# Altium project Ex.PrjPCB
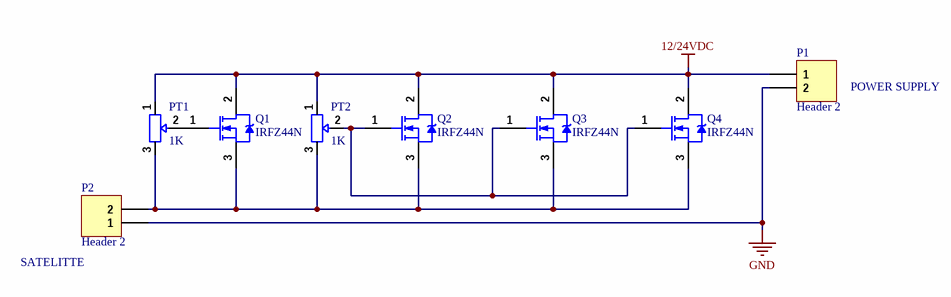
[diagram p0: Charge.SchDoc]
3 sheets, 43 parts. Net scope: global (net labels, ports and power ports of the same name join across sheets).
Sheets:
  Charge.SchDoc
  TEST_BENCH.SchDoc
  TEST_BENCH_2.SchDoc

## Sheet Charge.SchDoc: SCHEMA
size A4; Date: 01/01/2000; Author: Rachid AKKOUCHE; CompanyName: RASoftware; DrawnBy: Rachid AKKOUCHE; Engineer: Rachid AKKOUCHE; Organization: RASoftware; Address1: 52J-03 rue de la crèche; Address3: 77100 MEAUX; Address4: FRANCE; DocumentNumber: 01; Revision: A; SheetNumber: 1; SheetTotal: 1; Dessinepar: Rachid AKKOUCHE; Property: RASoftware; PageSetup: Record=PageOptions|CenterHorizontal=True|CenterVertical=True|PrintScale=0.88|XCorrection=1.00|YCorrection=1.00|PrintKind=0|BorderSize=5000000|LeftOffset=0|BottomOffset=0|Orientation=2|PaperLength=1000|PaperWidth=1000|Scale=100|PaperSource=7|PrintQuality=-3|MediaType=1|DitherType=10|PrintScaleMode=1|PaperKind=16K|PaperIndex=409; Time: 00:00; ProjectName: Projet BRA; Application_BuildNumber: 01

### Parts
(Parts that share a designator on the sheet are numbered #1, #2 ... from top to bottom, then left to right.)
P1#1  Header 2  [HDR1X2]
P2#1  Header 2  [HDR1X2]
PT1  1K  [3361P]
PT2  1K  [3361P]
Q1  IRFZ44N  [TO-220AB]
Q2  IRFZ44N  [TO-220AB]
Q3  IRFZ44N  [TO-220AB]
Q4  IRFZ44N  [TO-220AB]

### Nets
12/24VDC: P1#1.1 PT1.1 PT2.1 Q1.2(D) Q2.2(D) Q3.2(D) Q4.2(D)
GND: P1#1.2 P2#1.1
NetP2#1_2: P2#1.2 PT1.3 PT2.3 Q1.3(S) Q2.3(S) Q3.3(S) Q4.3(S)
NetPT1_2: PT1.2 Q1.1(G)
NetPT2_2: PT2.2 Q2.1(G) Q3.1(G) Q4.1(G)

### Notes on the sheet
- POWER SUPPLY
- SATELITTE
- Ce document est la propriété de
- Project:
- Il ne peut être divulgué sans l'accord écrit de l'un de ses représentants dûment mandaté
- Title:
- Number:
- Date:
- Time:
- Size:
- A4
- Revision:
- Sheet
- of
- 52 J03 rue de la crèche
- Draw by:
- 77100 Meaux

### Library data of the parts
P1#1 P2#1 = Header 2: Header, 2-Pin; LatestRevisionDate: 17-Jul-2002; LatestRevisionNote: Re-released for DXP Platform.; Publisher: Altium Limited
PT1 PT2 = RV
Q1-Q4 = IRFZ44N: HEXFET Power MOSFET; Note: Pin 2 is electrically connected to pin 4.; Published: 8-Jun-2000; LatestRevisionDate: 17-Jul-2002; LatestRevisionNote: Re-released for DXP Platform.; DatasheetVersion: Aug-1997; PackageVersion: Feb-1997; PackageReference: TO-220AB; Publisher: Altium Limited; PackageDescription: TO, Thru-Hole, Vertical, Heatsink Mounted; 3 In-Line Leads; Pitch 2.54 mm; ComponentLink1Description: Manufacturer Link; ComponentLink1URL: http://www.irf.com/; ComponentLink2Description: Datasheet; ComponentLink2URL: http://www.irf.com/product-info/datasheets/data/irfz44n.pdf

## Sheet TEST_BENCH.SchDoc: SCHEMA
size A4; Date: 01/01/2000; Author: Rachid AKKOUCHE; CompanyName: RASoftware; DrawnBy: Rachid AKKOUCHE; Engineer: Rachid AKKOUCHE; Organization: RASoftware; Address1: 52J-03 rue de la crèche; Address3: 77100 MEAUX; Address4: FRANCE; DocumentNumber: 01; Revision: A; SheetNumber: 1; SheetTotal: 1; Dessinepar: Rachid AKKOUCHE; Property: RASoftware; Time: 00:00; ProjectName: Projet BRA; Application_BuildNumber: 01
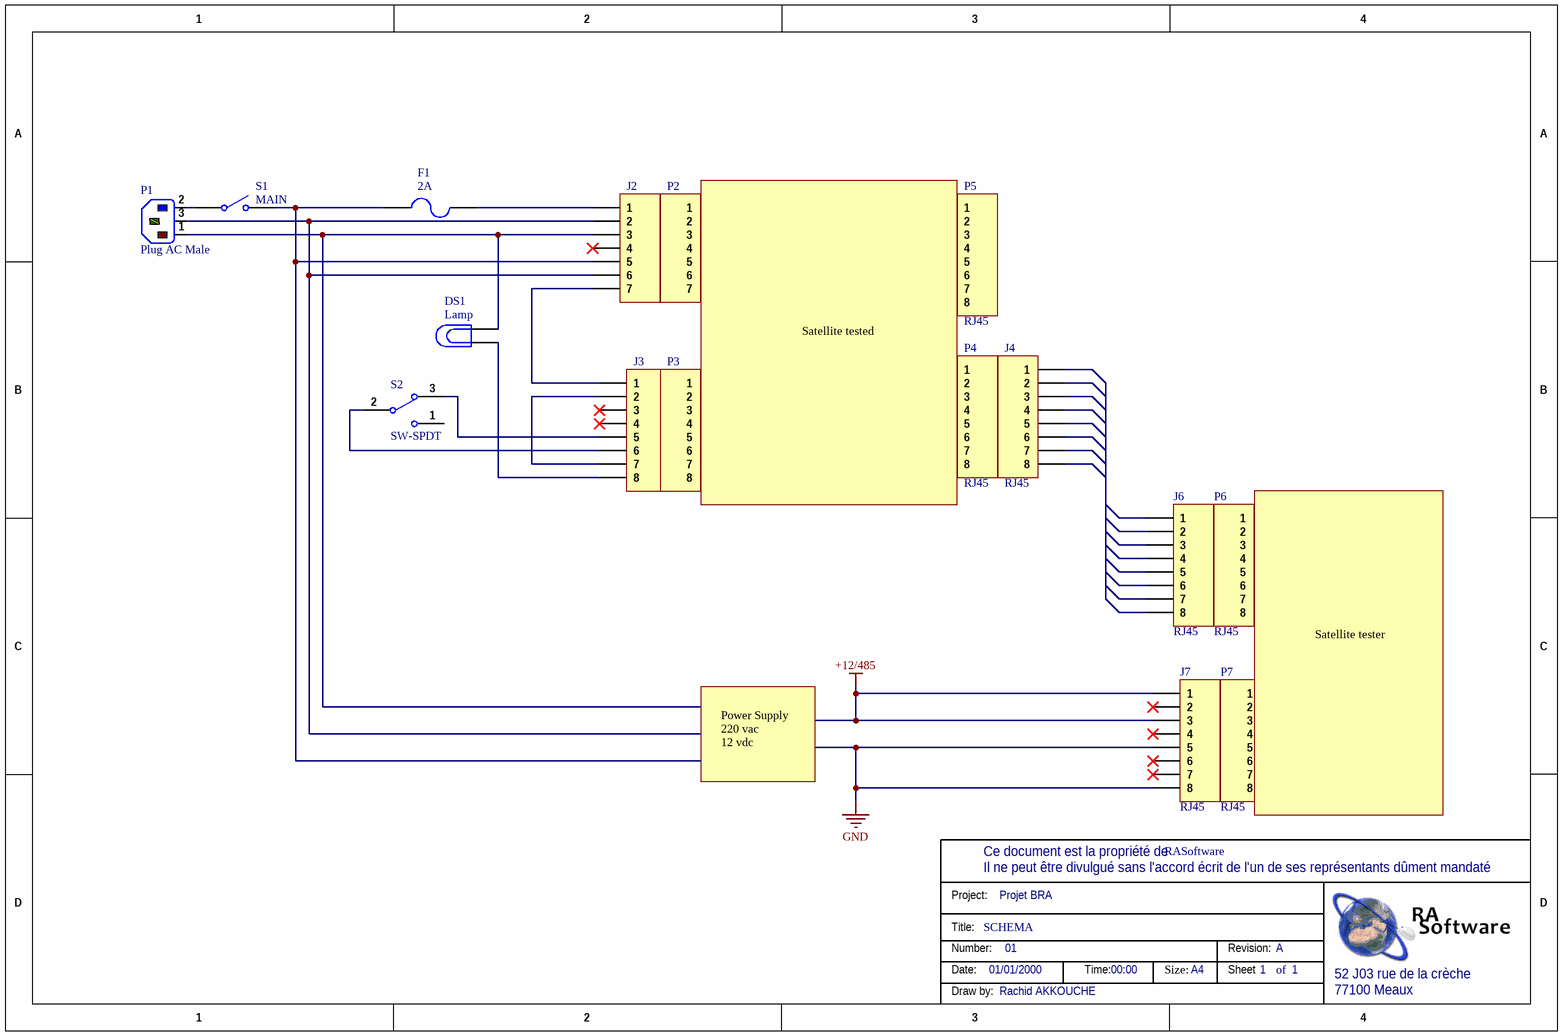
[diagram p1: TEST_BENCH.SchDoc]

### Parts
(Parts that share a designator on the sheet are numbered #1, #2 ... from top to bottom, then left to right.)
DS1  Lamp  [PIN2]
F1  2A  [PIN-W2/E2.8]
J2#1  Header 7  [CO7P508-90]  (value not drawn)
J3  Header 8  [CO8P508 - 90°]  (value not drawn)
J4  RJ45  [AMPHENOL-RJ45_8]
J6  RJ45  [AMPHENOL-RJ45_8]
J7  RJ45  [AMPHENOL-RJ45_8]
P1#2  Plug AC Male  [IEC9.14-2H3]
P2#2  Header 7  [CO7P508-90]  (value not drawn)
P3  Header 8  [CO8P508 - 90°]  (value not drawn)
P4  RJ45  [AMPHENOL-RJ45_8]
P5  RJ45  [AMPHENOL-RJ45_8]
P6  RJ45  [AMPHENOL-RJ45_8]
P7  RJ45  [AMPHENOL-RJ45_8]
S1#1  MAIN  [SPST-2]
S2#1  SW-SPDT  [TL36WW15050]

### Nets
+12/485: J7.1 J7.3
GND: J7.5 J7.8
NetDS1_1: DS1.1 J3.8
NetDS1_2: DS1.2 J2#1.3 P1#2.1(L)
NetF1_1: F1.1 J2#1.5 S1#1.2(NO)
NetF1_2: F1.2 J2#1.1
NetJ2#1_2: J2#1.2 J2#1.6 P1#2.3(E)
NetJ2#1_7: J2#1.7 J3.1
NetJ3_2: J3.2 J3.7
NetJ3_5: J3.5 S2#1.3
NetJ3_6: J3.6 S2#1.2
NetP1#2_2: P1#2.2(N) S1#1.1(COMMON)

Not connected (* = marked no-connect by the designer): J2#1 4*; J3 3* 4*; J4 1 2 3 4 5 6 7 8; J6 1 2 3 4 5 6 7 8; J7 2* 4* 6* 7*; P2#2 1 2 3 4 5 6 7; P3 1 2 3 4 5 6 7 8; P4 1 2 3 4 5 6 7 8; P5 1 2 3 4 5 6 7 8; P6 1 2 3 4 5 6 7 8; P7 1 2 3 4 5 6 7 8; S2#1 1

### Notes on the sheet
- Satellite tested
- Satellite tester
- Power Supply
  220 vac
  12 vdc
- Ce document est la propriété de
- Project:
- Il ne peut être divulgué sans l'accord écrit de l'un de ses représentants dûment mandaté
- Title:
- Number:
- Date:
- Time:
- Size:
- A4
- Revision:
- Sheet
- of
- 52 J03 rue de la crèche
- Draw by:
- 77100 Meaux

### Library data of the parts
DS1 = Lamp: Incandescent Bulb; Published: 24-Mar-1999; LatestRevisionDate: 17-Jul-2002; LatestRevisionNote: Re-released for DXP Platform.; PackageReference: PIN2; Publisher: Altium Limited
F1 = Fuse 2: Fuse; Published: 8-Jun-2000; LatestRevisionDate: 17-Jul-2002; LatestRevisionNote: Re-released for DXP Platform.; PackageReference: PIN-W2/E2.8; Publisher: Altium Limited; PackageDescription: Thru-Hole; 2 Leads
J2#1 P2#2 = Header 7: Header, 7-Pin; Manufacturer: FCI; Manufacturer Part Number: 20020110-H071A01LF; Anschlussart: Löten; Anzahl der Kontakte: 7; Anzahl der Reihen: 1; Betriebsspannung: 300 V ac; Breite: 12mm; Farbe: Grün; Gehäuseausrichtung: Rechtwinklig; Gender: Male; Länge: 37.56mm; Montagetyp: Durchsteckmontage; Nennstrom: 12A; Raster: 5.08mm; Serie: 06-508; Tiefe: 8.5mm; Typ: Stiftsockel; Currency: ÿNILÿ; Product StockNumber: 707-5477; Connecteur femelle: 790-0714; LatestRevisionDate: 17-Jul-2002; LatestRevisionNote: Re-released for DXP Platform.; Publisher: Altium Limited; Supplier 1: RS-Components; Supplier Part Number 1: 707-5477; RoHS: Compliant; Category: Steckverbinder; Stock 1: 0; Pricing 1: 5=0,778, 375=0,682, 1250=0,584, 2500=0,486, 5000=0,39 (ÿNILÿ); Material: Nylon; Product Status: ÿNILÿ; Future Stock Date: ÿNILÿ
J3 P3 = Header 8: Header, 8-Pin; Manufacturer: CAMDENBOSS; Manufacturer Part Number: CTB9350/8AO; Gamme de produit: CAMDENBOSS - CTB9350; Type de terminaison de contact: Traversant; Genre: Mâle; Nombre de contacts: 8; Nombre de rangées: 1; Pas: 5; Plaquage du contact: Cuivre; Matériau du contact: Laiton; SVHC: No SVHC (16-Jun-2014); Couleur: vert; Courant: 12; Inflammabilité: UL94V-0; Matériau, vis: Acier; Méthode de terminaison: A souder; Taille du filetage: M3; Température de fonctionnement max..: 125; Température d'utilisation min: -20; Tension nominale Vac: 380; Terminaison du contact: Traversant à angle droit<!--FANDB--><div class="features-and-benefits-container"></div>; Connecteur femelle: 3881891; LatestRevisionDate: 17-Jul-2002; LatestRevisionNote: Re-released for DXP Platform.; Publisher: Altium Limited; Supplier 1: Farnell; Supplier Part Number 1: 3882251; RoHS: YES; Pricing 1: 1=0,963, 25=0,847, 100=0,793, 250=0,732, 700=0,659, 3000=0,581, 3000=0,523, 20000=0,471 (EUR); ComponentLink1URL: http://www.farnell.com/datasheets/1708040.pdf; ComponentLink1Description: http://www.farnell.com/datasheets/1708040.pdf
J4 J6 J7 P4-P7 = Header 8: Header, 8-Pin; Manufacturer: MOLEX; Manufacturer Part Number: 85513-5013; Genre: Embase; Nombre de contacts: 8; Nombre de ports: 1; Catégorie LAN: Cat3; Terminaison du contact: Montage en surface vertical; Plaquage du contact: Or; Matériau du contact: Bronze phosphoreux; Approval Category: UL 94V-0; Couleur: Black; Courant: 1.5; Force diélectrique, Vca: 1000; Inflammabilité: UL94V-0; Largeur (externe): 15.9; Longueur/hauteur: 13; Matière: Glass Filled LCP; Profondeur: 18.8; Résistance d'isolement: 500; Résistance, contact: 20; Température de fonctionnement max..: 80; Température d'utilisation min: -40; Tension c.a.: 125; Supplier 1: Farnell; Supplier Part Number 1: 1345055; RoHS: YES; Pricing 1: 1=0,98, 10=0,92, 50=0,86, 100=0,74 (EUR); Type de connecteur: RJ45; Nombre de positions: 8; Body Plating: Or; Nombre de voies: 8; ComponentLink1URL: http://www.farnell.com/cad/1734187.pdf; ComponentLink1Description: http://www.farnell.com/cad/1734187.pdf; ComponentLink2URL: http://www.farnell.com/datasheets/1733622.pdf; ComponentLink2Description: http://www.farnell.com/datasheets/1733622.pdf
P1#2 = Plug AC Male: IEC Mains Power Inlet, EN60 320-1 C14 Class I Cold Condition, PC Flange Rear Mount, Chassis Plug; PackageDocument: ver.80, 15-Sep-2003; MaximumRating: 10A, 250V a.c. (UL & CSA 15A, 250V a.c.); MountingFixtures: Not drawn on schematic symbol.; PCB_Layout: Complies with manufacturer's recommendation.; DrillSize: Corresponds to nominal value.; Note: IEC Color Scheme employed for L, N and E.; Published: 15-Jul-2004; LatestRevisionDate: 15-Jul-2004; LatestRevisionNote: Component Replaced.; DatasheetDocument: ver.80, 15-Sep-2003; PackageReference: PX0580/PC; Publisher: Altium Limited; Terminations: P.C. Spills; ComponentLink1Description: Manufacturer Link; ComponentLink1URL: http://www.bulgin.co.uk/
S1#1 = SW-SPST: Single-Pole, Single-Throw Switch; Published: 24-Mar-1999; LatestRevisionDate: 17-Jul-2002; LatestRevisionNote: Re-released for DXP Platform.; PackageReference: SPST-2; Publisher: Altium Limited; PackageDescription: Switch; 2 Leads
S2#1 = SW-SPDT: SPDT Subminiature Toggle Switch, Right Angle Mounting, Vertical Actuation; Published: 24-Mar-1999; LatestRevisionDate: 17-Dec-2003; LatestRevisionNote: Schematic revised, PCB Footprint replaced.; DatasheetVersion: 05-Dec-2000; PackageReference: TL36WW15050; Publisher: Altium Limited; PackageDescription: Switch; 4 Leads; ComponentLink1Description: Manufacturer Link; ComponentLink1URL: http://www.apem.com

## Sheet TEST_BENCH_2.SchDoc: SCHEMA
size A4; Date: 01/01/2000; Author: Rachid AKKOUCHE; CompanyName: RASoftware; DrawnBy: Rachid AKKOUCHE; Engineer: Rachid AKKOUCHE; Organization: RASoftware; Address1: 52J-03 rue de la crèche; Address3: 77100 MEAUX; Address4: FRANCE; DocumentNumber: 01; Revision: A; SheetNumber: 1; SheetTotal: 1; Dessinepar: Rachid AKKOUCHE; Property: RASoftware; Time: 00:00; ProjectName: Projet BRA; Application_BuildNumber: 01
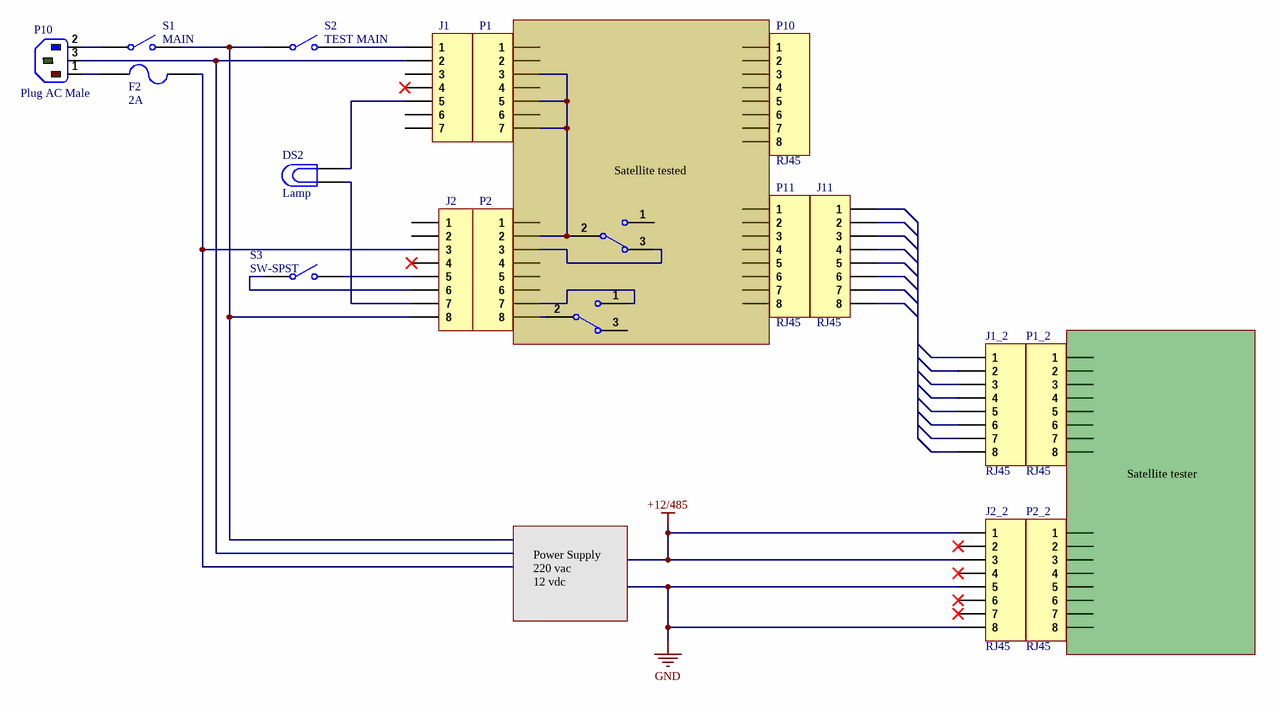
[diagram p2: TEST_BENCH_2.SchDoc]

### Parts
(Parts that share a designator on the sheet are numbered #1, #2 ... from top to bottom, then left to right.)
DS2  Lamp  [PIN2]
F2  2A  [PIN-W2/E2.8]
J1  Header 7  [CO7P508-90]  (value not drawn)
J1_2  RJ45  [AMPHENOL-RJ45_8]
J2#2  Header 8  [CO8P508 - 90°]  (value not drawn)
J2_2  RJ45  [AMPHENOL-RJ45_8]
J11  RJ45  [AMPHENOL-RJ45_8]
P1#3  Header 7  [CO7P508-90]  (value not drawn)
P1_2  RJ45  [AMPHENOL-RJ45_8]
P2#3  Header 8  [CO8P508 - 90°]  (value not drawn)
P2_2  RJ45  [AMPHENOL-RJ45_8]
P10#1  RJ45  [AMPHENOL-RJ45_8]
P10#2  Plug AC Male  [IEC9.14-2H3]
P11  RJ45  [AMPHENOL-RJ45_8]
S1#2  MAIN  [SPST-2]
S2#2  TEST MAIN  [SPST-2]
S3  SW-SPST  [SPST-2]
S?#1  SW-SPDT  [TL36WW15050]  (value not drawn)
S?#2  SW-SPDT  [TL36WW15050]  (value not drawn)

### Nets
+12/485: J2_2.1 J2_2.3
GND: J2_2.5 J2_2.8
NetDS2_1: DS2.1 J2#2.7
NetDS2_2: DS2.2 J1.5
NetF2_1: F2.1 P10#2.1(L)
NetF2_2: F2.2 J2#2.3
NetJ1_1: J1.1 S2#2.2(NO)
NetJ1_2: J1.2 P10#2.3(E)
NetJ2#2_5: J2#2.5 S3.2(NO)
NetJ2#2_6: J2#2.6 S3.1(COMMON)
NetJ2#2_8: J2#2.8 S1#2.2(NO) S2#2.1(COMMON)
NetP1#3_3: P1#3.3 P1#3.5 P1#3.7 P2#3.2 S?#1.2
NetP2#3_3: P2#3.3 S?#1.3
NetP2#3_7: P2#3.7 S?#2.1
NetP2#3_8: P2#3.8 S?#2.2
NetP10#2_2: P10#2.2(N) S1#2.1(COMMON)

Not connected (* = marked no-connect by the designer): J1 3 4* 6 7; J1_2 1 2 3 4 5 6 7 8; J2#2 1 2 4*; J2_2 2* 4* 6* 7*; J11 1 2 3 4 5 6 7 8; P1#3 1 2 4 6; P1_2 1 2 3 4 5 6 7 8; P2#3 1 4 5 6; P2_2 1 2 3 4 5 6 7 8; P10#1 1 2 3 4 5 6 7 8; P11 1 2 3 4 5 6 7 8; S?#1 1; S?#2 3

### Notes on the sheet
- (near S?#1) Satellite tested
- Satellite tester
- Power Supply
  220 vac
  12 vdc
- Ce document est la propriété de
- Project:
- Il ne peut être divulgué sans l'accord écrit de l'un de ses représentants dûment mandaté
- Title:
- Number:
- Date:
- Time:
- Size:
- A4
- Revision:
- Sheet
- of
- 52 J03 rue de la crèche
- Draw by:
- 77100 Meaux

### Library data of the parts
DS2 = Lamp: Incandescent Bulb; Published: 24-Mar-1999; LatestRevisionDate: 17-Jul-2002; LatestRevisionNote: Re-released for DXP Platform.; PackageReference: PIN2; Publisher: Altium Limited
F2 = Fuse 2: Fuse; Published: 8-Jun-2000; LatestRevisionDate: 17-Jul-2002; LatestRevisionNote: Re-released for DXP Platform.; PackageReference: PIN-W2/E2.8; Publisher: Altium Limited; PackageDescription: Thru-Hole; 2 Leads
J1 P1#3 = Header 7: as J2#1 on sheet TEST_BENCH; LatestRevisionDate: 17-Jul-2002; LatestRevisionNote: Re-released for DXP Platform.; Publisher: Altium Limited; Supplier 1: RS-Components; Supplier Part Number 1: 707-5477; RoHS: Compliant; Category: Steckverbinder; Stock 1: 0; Pricing 1: 5=0,778, 375=0,682, 1250=0,584, 2500=0,486, 5000=0,39 (ÿNILÿ); Material: Nylon; Product Status: ÿNILÿ; Future Stock Date: ÿNILÿ
J1_2 J2_2 J11 P1_2 P2_2 P10#1 P11 = Header 8: as J4 on sheet TEST_BENCH; Supplier 1: Farnell; Supplier Part Number 1: 1345055; RoHS: YES; Pricing 1: 1=0,98, 10=0,92, 50=0,86, 100=0,74 (EUR); Type de connecteur: RJ45; Nombre de positions: 8; Body Plating: Or; Nombre de voies: 8; ComponentLink1URL: http://www.farnell.com/cad/1734187.pdf; ComponentLink1Description: http://www.farnell.com/cad/1734187.pdf; ComponentLink2URL: http://www.farnell.com/datasheets/1733622.pdf; ComponentLink2Description: http://www.farnell.com/datasheets/1733622.pdf
J2#2 P2#3 = Header 8: as J3 on sheet TEST_BENCH; LatestRevisionDate: 17-Jul-2002; LatestRevisionNote: Re-released for DXP Platform.; Publisher: Altium Limited; Supplier 1: Farnell; Supplier Part Number 1: 3882251; RoHS: YES; Pricing 1: 1=0,963, 25=0,847, 100=0,793, 250=0,732, 700=0,659, 3000=0,581, 3000=0,523, 20000=0,471 (EUR); ComponentLink1URL: http://www.farnell.com/datasheets/1708040.pdf; ComponentLink1Description: http://www.farnell.com/datasheets/1708040.pdf
P10#2 = Plug AC Male: as P1#2 on sheet TEST_BENCH; Published: 15-Jul-2004; LatestRevisionDate: 15-Jul-2004; LatestRevisionNote: Component Replaced.; DatasheetDocument: ver.80, 15-Sep-2003; PackageReference: PX0580/PC; Publisher: Altium Limited; Terminations: P.C. Spills; ComponentLink1Description: Manufacturer Link; ComponentLink1URL: http://www.bulgin.co.uk/
S1#2 S2#2 S3 = SW-SPST: Single-Pole, Single-Throw Switch; Published: 24-Mar-1999; LatestRevisionDate: 17-Jul-2002; LatestRevisionNote: Re-released for DXP Platform.; PackageReference: SPST-2; Publisher: Altium Limited; PackageDescription: Switch; 2 Leads
S?#1 S?#2 = SW-SPDT: as S2#1 on sheet TEST_BENCH; Published: 24-Mar-1999; LatestRevisionDate: 17-Dec-2003; LatestRevisionNote: Schematic revised, PCB Footprint replaced.; DatasheetVersion: 05-Dec-2000; PackageReference: TL36WW15050; Publisher: Altium Limited; PackageDescription: Switch; 4 Leads; ComponentLink1Description: Manufacturer Link; ComponentLink1URL: http://www.apem.com

## Nets that join several sheets
+12/485: TEST_BENCH (J7.1 J7.3), TEST_BENCH_2 (J2_2.1 J2_2.3)
GND: Charge (P1#1.2 P2#1.1), TEST_BENCH (J7.5 J7.8), TEST_BENCH_2 (J2_2.5 J2_2.8)